# EAGLE design debounce_rev_2 (EAGLE 6.3)
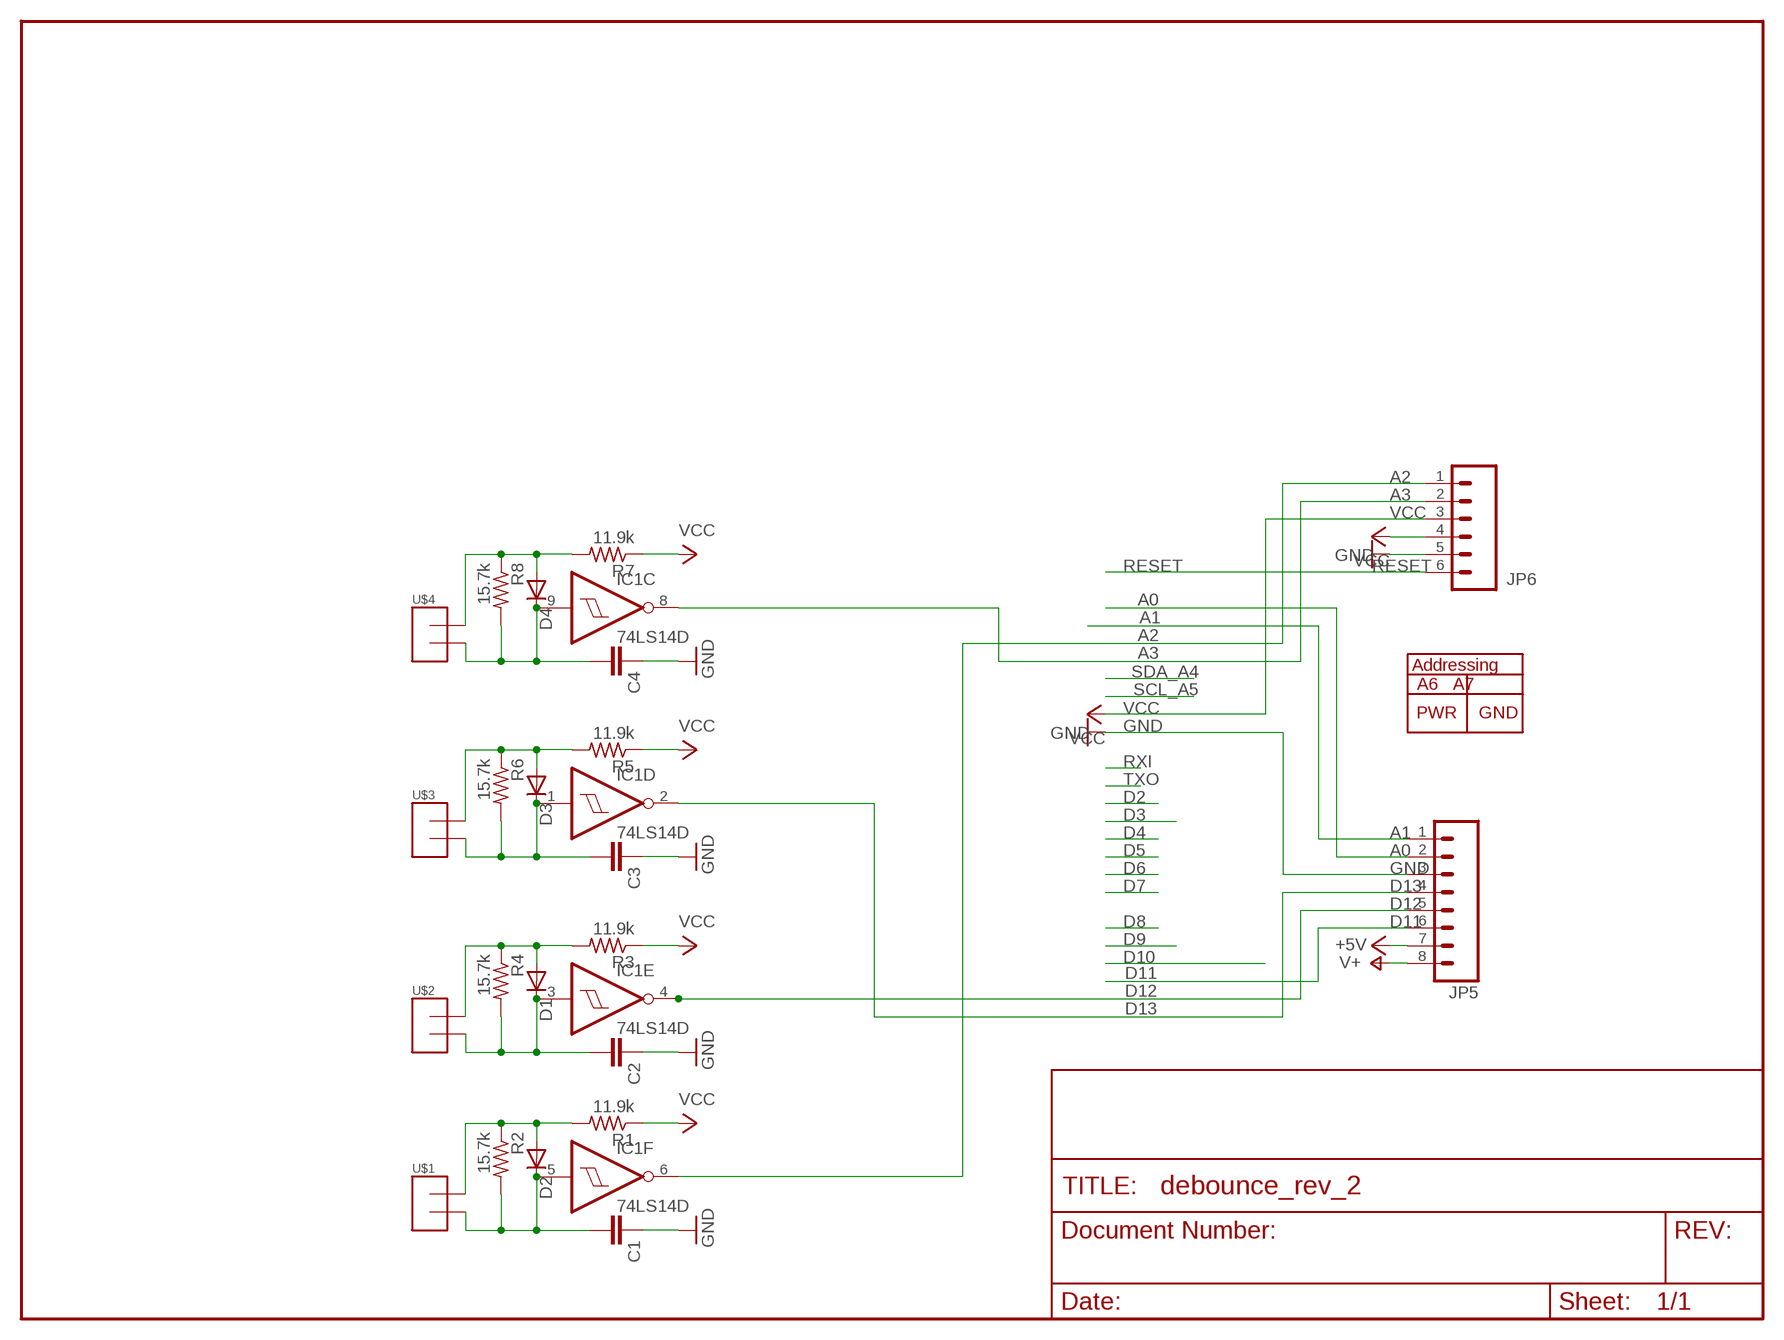
[diagram p0: schematic, sheet 1]

## Parts
C1  CAPPTH  [CAP-PTH-SMALL]
C2  CAPPTH  [CAP-PTH-SMALL]
C3  CAPPTH  [CAP-PTH-SMALL]
C4  CAPPTH  [CAP-PTH-SMALL]
D1  DIODE-D-2.5  [D-2.5]
D2  DIODE-D-2.5  [D-2.5]
D3  DIODE-D-2.5  [D-2.5]
D4  DIODE-D-2.5  [D-2.5]
IC1  74LS14D  [SO14]
JP5  M081X08  [1X08]
JP6  M06SIP  [1X06]
R1  11.9k  R-US_0204/2V  [0204V]
R2  15.7k  R-US_0204/2V  [0204V]
R3  11.9k  R-US_0204/2V  [0204V]
R4  15.7k  R-US_0204/2V  [0204V]
R5  11.9k  R-US_0204/2V  [0204V]
R6  15.7k  R-US_0204/2V  [0204V]
R7  11.9k  R-US_0204/2V  [0204V]
R8  15.7k  R-US_0204/2V  [0204V]
U$1  TERMINAL2  [TERMINAL_2]
U$2  TERMINAL2  [TERMINAL_2]
U$3  TERMINAL2  [TERMINAL_2]
U$4  TERMINAL2  [TERMINAL_2]

## Nets
+5V: JP5.7
A0: JP5.2
A1: JP5.1
A2: IC1.6(F:O) JP6.1
A3: IC1.8(C:O) JP6.2
D11: JP5.6
D12: IC1.4(E:O) JP5.5
D13: IC1.2(D:O) JP5.4
GND: C1.1 C2.1 C3.1 C4.1 JP5.3 JP6.5
N$1: D1.A R3.2 R4.1 U$2.P$1
N$2: C2.2 D1.C IC1.3(E:I) R4.2 U$2.P$2
N$3: D2.A R1.2 R2.1 U$1.P$1
N$4: C1.2 D2.C IC1.5(F:I) R2.2 U$1.P$2
N$6: D3.A R5.2 R6.1 U$3.P$1
N$7: C3.2 D3.C IC1.1(D:I) R6.2 U$3.P$2
N$10: D4.A R7.2 R8.1 U$4.P$1
N$11: C4.2 D4.C IC1.9(C:I) R8.2 U$4.P$2
RESET: JP6.6
V+: JP5.8
VCC: JP6.3 JP6.4 R1.1 R3.1 R5.1 R7.1
Unconnected: IC1.10(B:O) IC1.11(B:I) IC1.12(A:O) IC1.13(A:I)

## Power pins joined to a net without a drawn wire
GND: IC1.7(P:GND)
VCC: IC1.14(P:VCC)

## Library data of the parts
C1-C4 = SparkFun:CAP: Capacitor Standard 0603 ceramic capacitor, and 0.1" leaded capacitor.
D1-D4 = diode:DIODE-: DIODE
IC1 = 74xx-us:74*14: Hex schmitt trigger INVERTER
JP5 = SparkFun_mod:M08: Header 8 Standard 8-pin 0.1" header. Use with straight break away headers (SKU : PRT-00116), right angle break away headers (PRT-00553), swiss pins (PRT-00743), machine pins (PRT-00117), and female headers (PRT-00115).
JP6 = SparkFun:M06: Header 6 Standard 6-pin 0.1" header. Use with straight break away headers (SKU : PRT-00116), right angle break away headers (PRT-00553), swiss pins (PRT-00743), machine pins (PRT-00117), and female headers (PRT-00115). Molex polarized connector foot print use with SKU : PRT-08094 with associated crimp pins and housings. NOTES ON THE VARIANTS LOCK and LOCK_LONGPADS... This footprint was designed to help hold the alignment of a through-hole component (i.e. 6-pin header) while soldering it into place. You may notice that each hole has been shifted either up or down by 0.005 of an inch from it's more standard position (which is a perfectly straight line). This slight alteration caused the pins (the squares in the middle) to touch the edges of the holes. Because they are alternating, it causes a "brace" to hold the component in place. 0.005 has proven to be the perfect amount of "off-center" position when using our standard breakaway headers. Although looks a little odd when you look at the bare footprint, once you have a header in there, the alteration is very hard to notice. Also, if you push a header all the way into place, it is covered up entirely on the bottom side. This idea of altering the position of holes to aid alignment will be further integrated into the Sparkfun Library for other footprints. It can help hold any component with 3 or more connection pins.
R1-R8 = adafruit:R-US_: RESISTOR, American symbol
U$1-U$4 = _my-parts:TERMINAL2

## Net classes
0 default: width 0.203 mm
1 vcc: width 0.254 mm

## Board
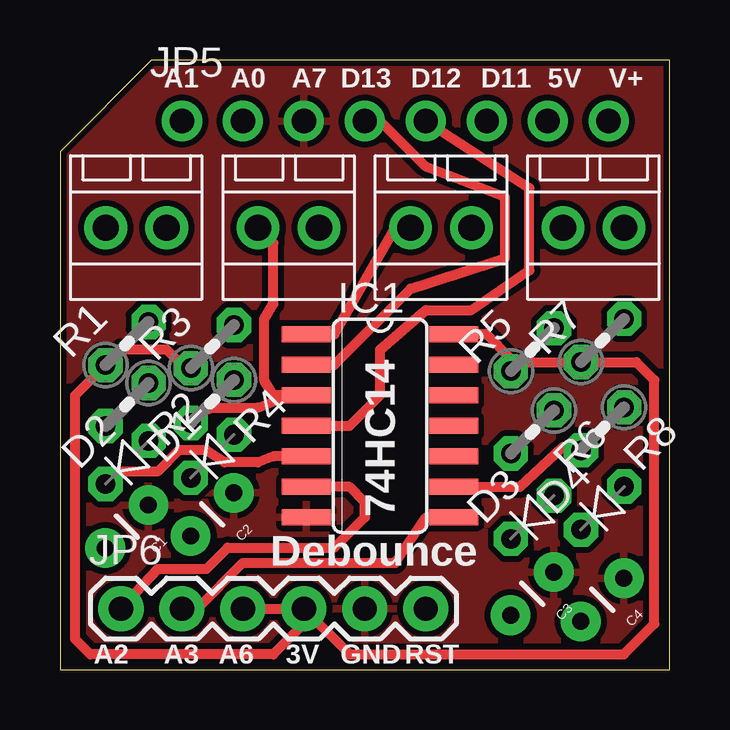
[diagram p1: board, top side]
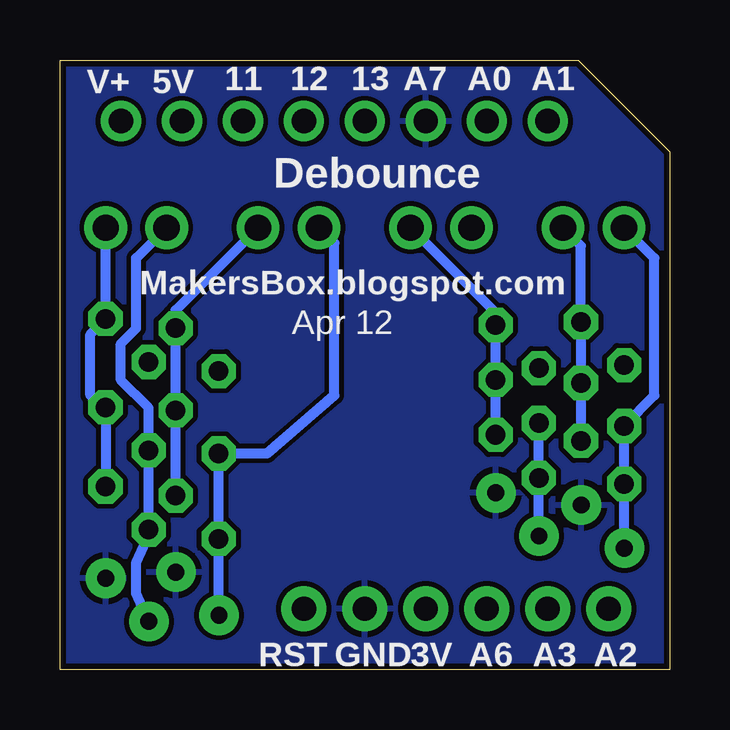
[diagram p2: board, bottom side, seen from below]

Size 25.4 x 25.4 mm. Coordinates in mm from the lower left corner, seen from the top.
Outline: 25.4,25.4 25.4,21.59 25.4,0 24.77,0 20.96,0 0,0 0,21.59
Outline: 25.4,25.4 3.81,25.4 0,21.59
Outline: 0,21.59 0,21.59
Copper layers (1*16): Top 0.035mm / dielectric 1.5mm / Bottom 0.035mm
Design rules "SparkFun": minimum track width 8mil, minimum drill 20mil, track to track 8mil, track to pad 8mil, pad to pad 8mil, via to via 8mil, smd to smd 8mil, copper to edge 10mil, drill to drill 8mil, minimum pad ring 12mil, minimum via ring 10mil, stop-mask expansion 4mil, vias tented up to drill 25mil, thermal gap 10mil

### Footprints (pad centres in the part's own frame; a part is rotated, then mirrored left to right if it is on the bottom)
CAP-PTH-SMALL = drill 0.7 pad 1.651: 1 0,0; 2 2.54,0
D-2.5 = drill 0.813 octagon: A 1.27,0; C -1.27,0
SO14 = smd 0.66 x 2.032: 1 -3.81,-3.073; 2 -2.54,-3.073; 3 -1.27,-3.073; 4 0,-3.073; 5 1.27,-3.073; 6 2.54,-3.073; 7 3.81,-3.073; 8 3.81,3.073; 9 2.54,3.073; 10 1.27,3.073; 11 0,3.073; 12 -1.27,3.073; 13 -2.54,3.073; 14 -3.81,3.073
1X08 = drill 1.016 pad 1.676: 1 0,0; 2 2.54,0; 3 5.08,0; 4 7.62,0; 5 10.16,0; 6 12.7,0; 7 15.24,0; 8 17.78,0
1X06 = drill 1.016 pad 1.88: 1 0,0; 2 2.54,0; 3 5.08,0; 4 7.62,0; 5 10.16,0; 6 12.7,0
0204V = drill 0.813 octagon: 1 -1.27,0; 2 1.27,0
TERMINAL_2 = drill 1.1 pad 1.778: P$1 1.27,0; P$2 -1.27,0

### Placement (x,y rotation side)
C1  3.68,6.86 225 top
C2  7.24,7.37 225 top
C3  20.57,4.06 225 top
C4  23.5,3.81 225 top
D1  6.35,8.89 45 top
D2  2.79,8.64 45 top
D3  19.68,6.35 45 top
D4  22.61,6.73 45 top
IC1  13.34,10.16 270 top
JP5  5.08,22.86 0 top
JP6  2.54,2.54 0 top
R1  2.79,13.59 45 top
R2  2.79,11.05 225 top
R3  6.35,13.46 45 top
R4  6.35,11.18 225 top
R5  19.68,13.34 45 top
R6  19.68,9.91 225 top
R7  22.61,13.72 45 top
R8  22.61,10.03 225 top
U$1  3.17,18.41 0 top
U$2  9.53,18.41 0 top
U$3  15.88,18.41 0 top
U$4  22.23,18.41 0 top

### Tracks (layer width: path | path; a pad name or v marks a point on that pad's centre or on a via)
A2
  Top 0.305: IC1.6 9.53,7.62
  Top 0.406: JP6.1 4.06,4.19 6.1,4.19 6.99,5.08 11.43,5.08 12.7,6.35 12.7,6.99 12.06,7.62 IC1.6
A3
  Top 0.406: JP6.2 5.71,2.54 7.62,4.45 13.97,4.45 15.24,6.35 IC1.8
D12
  Top 0.406: IC1.4 12.06,10.16 13.34,11.43 13.34,13.34 15.24,14.99 17.14,14.99 19.56,16.64 19.56,20.07 JP5.5
D13
  Top 0.406: IC1.2 11.43,12.7 14.61,15.88 18.54,17.14 18.54,19.68 15.24,20.95 13.34,22.86 JP5.4
GND
  pour Bottom: -1.27,26.67 26.67,26.67 26.67,-1.27 -1.27,-1.27
  pour Top (isolate 0.254): -0.64,26.04 26.67,26.04 26.67,0 26.04,-0.64 -0.64,-0.64
N$1
  Bottom 0.406: D1.A R4.1 R3.2 7.25,14.87 U$2.P$1
N$2
  Top 0.406: R4.2 5.45,10.53 6.35,10.92 8.26,10.92 9.53,11.43 | 9.53,11.43 IC1.3 | 9.53,11.43 8.89,11.43 8.51,12.06 8.51,14.61 8.89,15.24 8.89,17.78 U$2.P$2
  Bottom 0.406: C2.2 5.44,7.35 D1.C R4.2
N$3
  Bottom 0.406: U$1.P$1 3.69,17.66 R1.2 R2.1 D2.A
N$4
  Top 0.406: IC1.5 8.89,8.89 8.26,8.64 6.86,8.64 6.1,9.14 4.95,9.14 4.06,8.26 2.54,8.26 D2.C
  Bottom 0.406: C1.2 1.89,7.6 D2.C R2.2 1.9,10.17 0.64,11.43 0.64,17.14 U$1.P$2
N$6
  Bottom 0.406: D3.A R6.1 R5.2 20.58,14.98 U$3.P$1
N$7
  Top 0.406: IC1.1 11.43,13.97 13.97,18.41 U$3.P$2
  Bottom 0.406: C3.2 18.78,5.44 D3.C R6.2 16.77,9.01 13.97,11.43 13.97,17.78 U$3.P$2
N$10
  Bottom 0.406: D4.A R8.1 23.63,10.93 24.13,11.43 24.13,13.97 R7.2 U$4.P$1
N$11
  Top 0.406: IC1.9 19.18,7.62 20.95,9.27 21.7,9.27 R8.2
  Bottom 0.406: C4.2 22.23,3.17 22.23,4.45 21.7,5.61 D4.C R8.2 21.71,10.91 22.86,12.06 22.86,13.59 22.23,14.22 22.23,17.14 U$4.P$2
VCC
  Top 0.406: 5.71,12.7 R3.1 5.34,12.44 4.45,13.34 2.54,13.34 R1.1 0.64,11.43 0.64,1.27 1.27,0.64 8.89,0.64 10.16,1.91 JP6.4 | IC1.14 17.78,13.97 18.79,12.96 R5.1 19.04,12.82 R7.1 24.01,12.82 24.77,12.06 24.77,1.91 23.5,0.64 12.06,0.64 JP6.4 | JP6.3 JP6.4

### Text on the board
tPlace: A1 | A0 | A7 | D13 | D12 | D11 | 5V | V+ | 74HC14 | Debounce | A2 | A3 | A6 | 3V | GND | RST
bPlace: A1 | A0 | A7 | 13 | 12 | 5V | V+ | 11 | Debounce | MakersBox.blogspot.com | Apr 12 | A2 | A3 | A6 | 3V | GND | RST